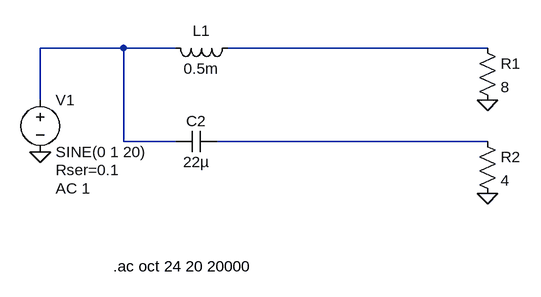
[diagram p0: schematic x-over.asc]
x-over.asc, the LTspice schematic file:
Version 4
SHEET 1 880 680
WIRE 112 48 -16 48
WIRE 192 48 112 48
WIRE 672 48 272 48
WIRE -16 128 -16 48
WIRE 112 192 112 48
WIRE 192 192 112 192
WIRE 672 192 256 192
FLAG -16 208 0
FLAG 672 272 0
FLAG 672 128 0
SYMBOL voltage -16 112 R0
WINDOW 123 24 152 Left 2
WINDOW 39 24 124 Left 2
SYMATTR InstName V1
SYMATTR Value SINE(0 1 20)
SYMATTR Value2 AC 1
SYMATTR SpiceLine Rser=0.1
SYMBOL ind 288 32 R90
WINDOW 0 5 56 VBottom 2
WINDOW 3 32 56 VTop 2
SYMATTR InstName L1
SYMATTR Value 0.5m
SYMATTR SpiceLine Rser=0.1
SYMBOL cap 256 176 R90
WINDOW 0 0 32 VBottom 2
WINDOW 3 32 32 VTop 2
SYMATTR InstName C2
SYMATTR Value 22µ
SYMBOL res 656 32 R0
SYMATTR InstName R1
SYMATTR Value 8
SYMBOL res 656 176 R0
SYMATTR InstName R2
SYMATTR Value 4
TEXT 96 384 Left 2 !.ac oct 24 20 20000

The netlist it stands for:
* x-over.asc
V1 N001 0 SINE(0 1 20) AC 1 Rser=0.1
L1 N002 N001 0.5m Rser=0.1
C2 N003 N001 22µ
R1 N002 0 8
R2 N003 0 4
.ac oct 24 20 20000
.backanno
.end